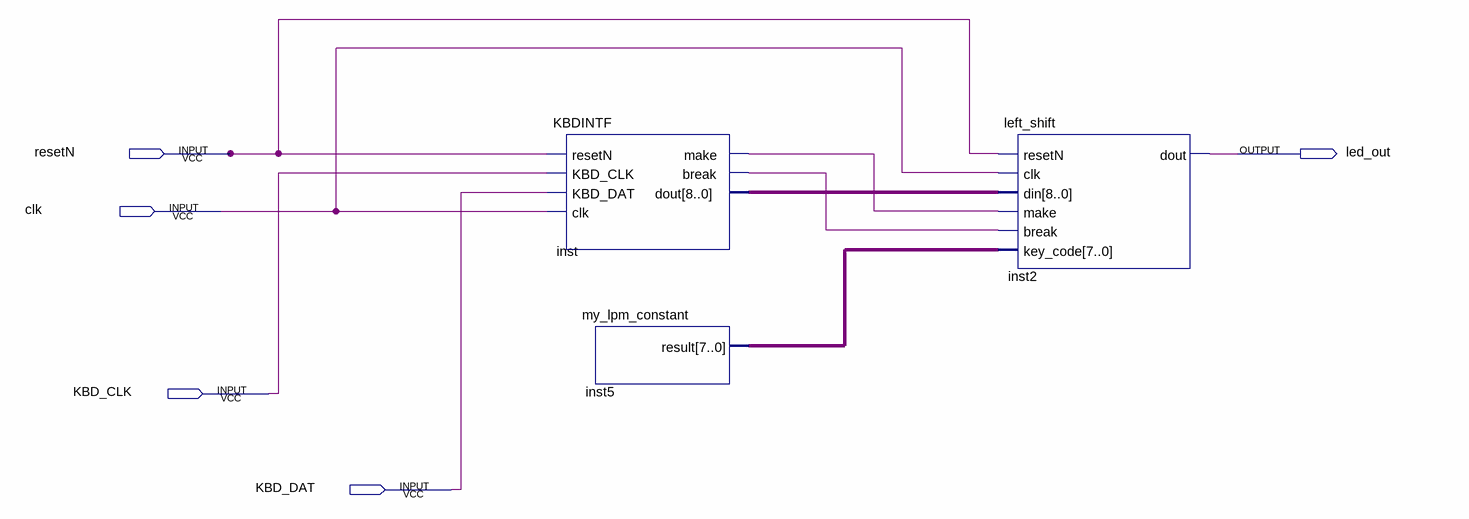
[diagram p0: schematic sheet]
// Quartus schematic Test_Toggle.bdf as structural Verilog: 3 symbols, 5 pins
module Test_Toggle (
  input  resetN,
  input  clk,
  input  KBD_CLK,
  input  KBD_DAT,
  output led_out
);

  wire inst_break, inst_make;
  wire [7:0] inst5_result;
  wire [8:0] inst_dout;

  KBDINTF inst (
    .resetN(resetN), .KBD_CLK(KBD_CLK), .KBD_DAT(KBD_DAT), .clk(clk), .make(inst_make), .\break (inst_break),
    .dout(inst_dout));
  my_lpm_constant inst5 (.result(inst5_result));
  left_shift inst2 (
    .resetN(resetN), .clk(clk), .din(inst_dout), .make(inst_make), .\break (inst_break),
    .key_code(inst5_result), .dout(led_out));
endmodule
